# EAGLE design tvc-gamecard-GAL-v2.2smd (EAGLE 8.3.1)
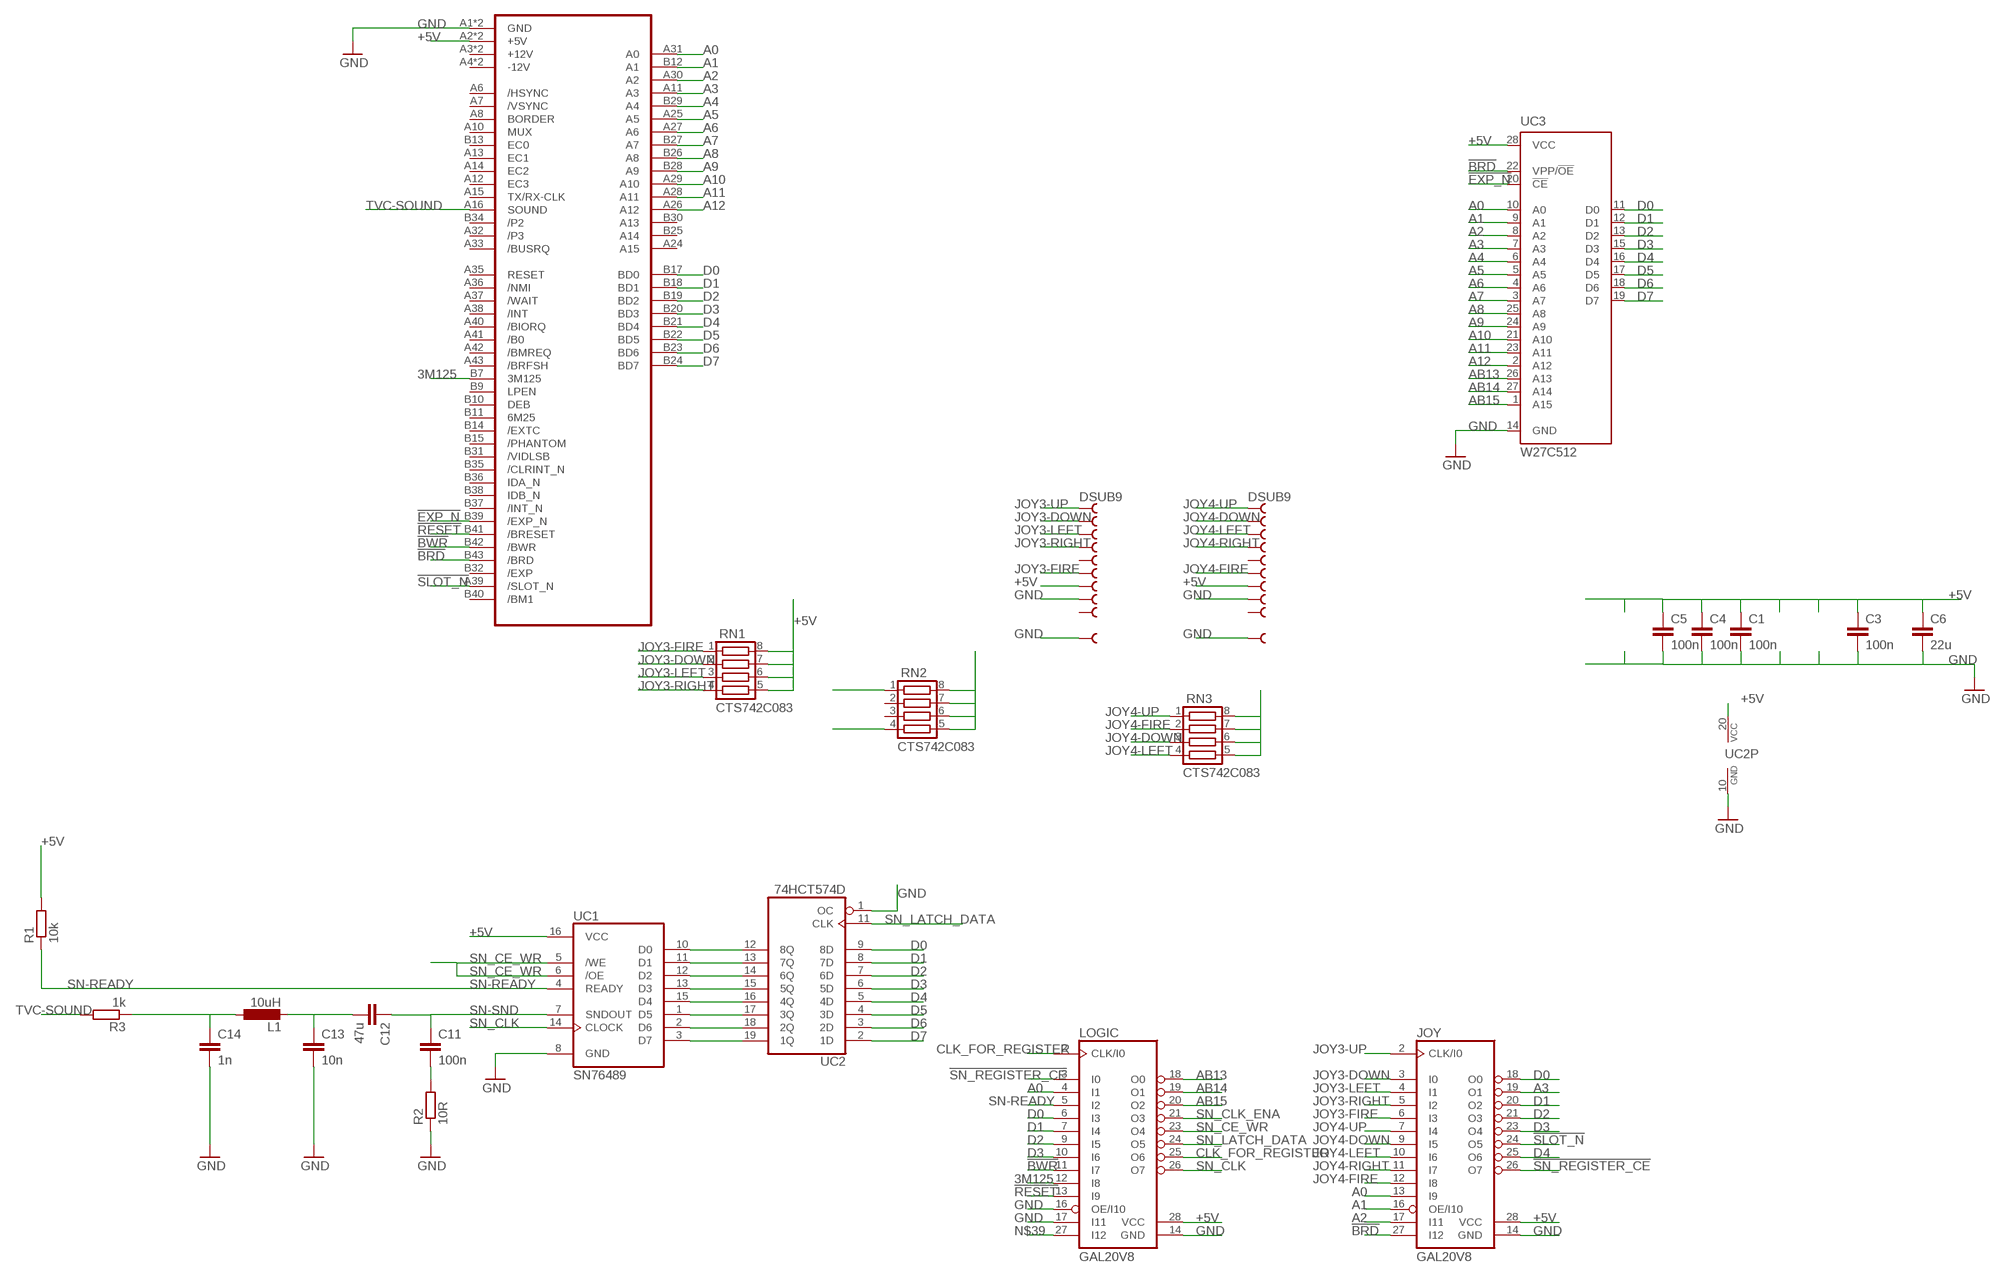
[diagram p0: schematic, sheet 1]

## Parts
C1  100n  C-EUC0805  [C0805]
C3  100n  C-EUC0805  [C0805]
C4  100n  C-EUC0805  [C0805]
C5  100n  C-EUC0805  [C0805]
C6  22u  C-EUC0805  [C0805]
C11  100n  C-EUC0805  [C0805]
C12  47u  C-EUC1206  [C1206]
C13  10n  C-EUC0805  [C0805]
C14  1n  C-EUC0805  [C0805]
CON1  TVC-EXP-HBA-COMMON  [TVC-EXP-EDGE]
JOY  GAL20V8  GAL20V8-PLCC  [PLCC-S28-SOCKET]
JOY3  DSUB9  [H3M09RA]
JOY4  DSUB9  [H3M09RA]
L1  10uH  L-1210  [L1210]
LOGIC  GAL20V8  GAL20V8-PLCC  [PLCC-S28-SOCKET]
R1  10k  R-EU_R0805  [R0805]
R2  10R  R-EU_R0805  [R0805]
R3  1k  R-EU_R0805  [R0805]
RN1  CTS742C083  [CTS742C083]
RN2  CTS742C083  [CTS742C083]
RN3  CTS742C083  [CTS742C083]
UC1  SN76489  [DIL16]
UC2  74HCT574D  [SO20W]
UC3  W27C512  [DIL28-6]

## Nets
3M125: CON1.B7(3M125) LOGIC.12(I8)
!BRD: CON1.B43(/BRD) JOY.27(I12) UC3.22(VPP/!OE)
!BWR: CON1.B42(/BWR) LOGIC.11(I7)
!EXP_N: CON1.B39(/EXP_N) UC3.20(!CE)
!RESET: CON1.B41(/BRESET) LOGIC.13(I9)
!SLOT_N: CON1.A39(/SLOT_N) JOY.24(O5)
!SN_REGISTER_CE: JOY.26(O7) LOGIC.3(I0)
+5V [power]: C1.1 C3.1 C4.1 C5.1 C6.1 CON1.A2(+5V) CON1.B2(+5V) JOY3.7 JOY4.7 JOY.28(VCC) LOGIC.28(VCC) R1.2 RN1.5 RN1.6 RN1.7 RN1.8 RN2.5 RN2.6 RN2.7 RN2.8 RN3.5 RN3.6 RN3.7 RN3.8 UC1.16(VCC) UC2.20(VCC) UC3.28(VCC)
A0: CON1.A31(A0) JOY.13(I9) LOGIC.4(I1) UC3.10(A0)
A1: CON1.B12(A1) JOY.16(OE/I10) UC3.9(A1)
A2: CON1.A30(A2) JOY.17(I11) UC3.8(A2)
A3: CON1.A11(A3) JOY.19(O1) UC3.7(A3)
A4: CON1.B29(A4) UC3.6(A4)
A5: CON1.A25(A5) UC3.5(A5)
A6: CON1.A27(A6) UC3.4(A6)
A7: CON1.B27(A7) UC3.3(A7)
A8: CON1.B26(A8) UC3.25(A8)
A9: CON1.B28(A9) UC3.24(A9)
A10: CON1.A29(A10) UC3.21(A10)
A11: CON1.A28(A11) UC3.23(A11)
A12: CON1.A26(A12) UC3.2(A12)
AB13: LOGIC.18(O0) UC3.26(A13)
AB14: LOGIC.19(O1) UC3.27(A14)
AB15: LOGIC.20(O2) UC3.1(A15)
CLK_FOR_REGISTER: LOGIC.2(CLK/I0) LOGIC.25(O6)
D0: CON1.B17(BD0) JOY.18(O0) LOGIC.6(I3) UC2.9(8D) UC3.11(D0)
D1: CON1.B18(BD1) JOY.20(O2) LOGIC.7(I4) UC2.8(7D) UC3.12(D1)
D2: CON1.B19(BD2) JOY.21(O3) LOGIC.9(I5) UC2.7(6D) UC3.13(D2)
D3: CON1.B20(BD3) JOY.23(O4) LOGIC.10(I6) UC2.6(5D) UC3.15(D3)
D4: CON1.B21(BD4) JOY.25(O6) UC2.5(4D) UC3.16(D4)
D5: CON1.B22(BD5) UC2.4(3D) UC3.17(D5)
D6: CON1.B23(BD6) UC2.3(2D) UC3.18(D6)
D7: CON1.B24(BD7) UC2.2(1D) UC3.19(D7)
GND [power]: C1.2 C3.2 C4.2 C5.2 C6.2 C13.2 C14.2 CON1.A1(GND) CON1.B1(GND) JOY3.8 JOY3.P$1(S) JOY3.P$2(S) JOY4.8 JOY4.P$1(S) JOY4.P$2(S) JOY.14(GND) LOGIC.14(GND) LOGIC.16(OE/I10) LOGIC.17(I11) R2.1 UC1.8(GND) UC2.1(OC) UC2.10(GND) UC3.14(GND)
JOY3-DOWN: JOY3.2 JOY.3(I0) RN1.2
JOY3-FIRE: JOY3.6 JOY.6(I3) RN1.1
JOY3-LEFT: JOY3.3 JOY.4(I1) RN1.3
JOY3-RIGHT: JOY3.4 JOY.5(I2) RN1.4
JOY3-UP: JOY3.1 JOY.2(CLK/I0) RN2.4
JOY4-DOWN: JOY4.2 JOY.9(I5) RN3.3
JOY4-FIRE: JOY4.6 JOY.12(I8) RN3.2
JOY4-LEFT: JOY4.3 JOY.10(I6) RN3.4
JOY4-RIGHT: JOY4.4 JOY.11(I7) RN2.1
JOY4-UP: JOY4.1 JOY.7(I4) RN3.1
N$1: C11.2 R2.2
N$3: C12.2 C13.1 L1.2
N$4: C14.1 L1.1 R3.1
N$6: UC1.10(D0) UC2.12(8Q)
N$7: UC1.11(D1) UC2.13(7Q)
N$8: UC1.12(D2) UC2.14(6Q)
N$9: UC1.13(D3) UC2.15(5Q)
N$10: UC1.15(D4) UC2.16(4Q)
N$11: UC1.1(D5) UC2.17(3Q)
N$12: UC1.2(D6) UC2.18(2Q)
N$13: UC1.3(D7) UC2.19(1Q)
N$39: LOGIC.27(I12)
SN-READY: LOGIC.5(I2) R1.1 UC1.4(READY)
SN-SND: C11.1 C12.1 UC1.7(SNDOUT)
SN_CE_WR: LOGIC.23(O4) UC1.5(/WE) UC1.6(/OE)
SN_CLK: LOGIC.26(O7) UC1.14(CLOCK)
SN_CLK_ENA: LOGIC.21(O3)
SN_LATCH_DATA: LOGIC.24(O5) UC2.11(CLK)
TVC-SOUND: CON1.A16(SOUND) R3.2
Unconnected: CON1.A3(+12V) CON1.A4(-12V) CON1.A6(/HSYNC) CON1.A7(/VSYNC) CON1.A8(BORDER) CON1.A10(MUX) CON1.A12(EC3) CON1.A13(EC1) CON1.A14(EC2) CON1.A15(TX/RX-CLK) CON1.A24(A15) CON1.A32(/P3) CON1.A33(/BUSRQ) CON1.A35(RESET) CON1.A36(/NMI) CON1.A37(/WAIT) CON1.A38(/INT) CON1.A40(/BIORQ) CON1.A41(/B0) CON1.A42(/BMREQ) CON1.A43(/BRFSH) CON1.B3(+12V) CON1.B4(-12V) CON1.B9(LPEN) CON1.B10(DEB) CON1.B11(6M25) CON1.B13(EC0) CON1.B14(/EXTC) CON1.B15(/PHANTOM) CON1.B25(A14) CON1.B30(A13) CON1.B31(/VIDLSB) CON1.B32(/EXP) CON1.B34(/P2) CON1.B35(/CLRINT_N) CON1.B36(IDA_N) CON1.B37(/INT_N) CON1.B38(IDB_N) CON1.B40(/BM1) JOY3.5 JOY3.9 JOY4.5 JOY4.9 RN2.2 RN2.3

## Library data of the parts
C1 C3-C6 C11-C14 = rcl:C-EU: CAPACITOR, European symbol
CON1 = tvc-exp:TVC-EXP-HBA-COMMON: Videoton TV-Computer expansion port edge connector, common pins for 32k, 64k and 64k+
JOY LOGIC = Lattice:GAL20V8-PLCC
JOY3 JOY4 = dsub90:DSUB9
L1 = SMD-L:L-1210
R1-R3 = rcl:R-EU_: RESISTOR, European symbol
RN1-RN3 = resistor-net:CTS742C083: Chip Resistor Array 4 Single Resistor Source: http://www.ctscorp.com/components/Datasheets/CTSChipArrayDs.pdf; OC_FARNELL: unknown; OC_NEWARK: unknown
UC1 = sn76489:SN76489
UC2 = 74xx-eu:74*574: 8-bit D type FLIP FLOP bus driver
UC3 = Winbond:W27C512

## Net classes
1 power: width 0.508 mm, clearance 0.254 mm

## Board
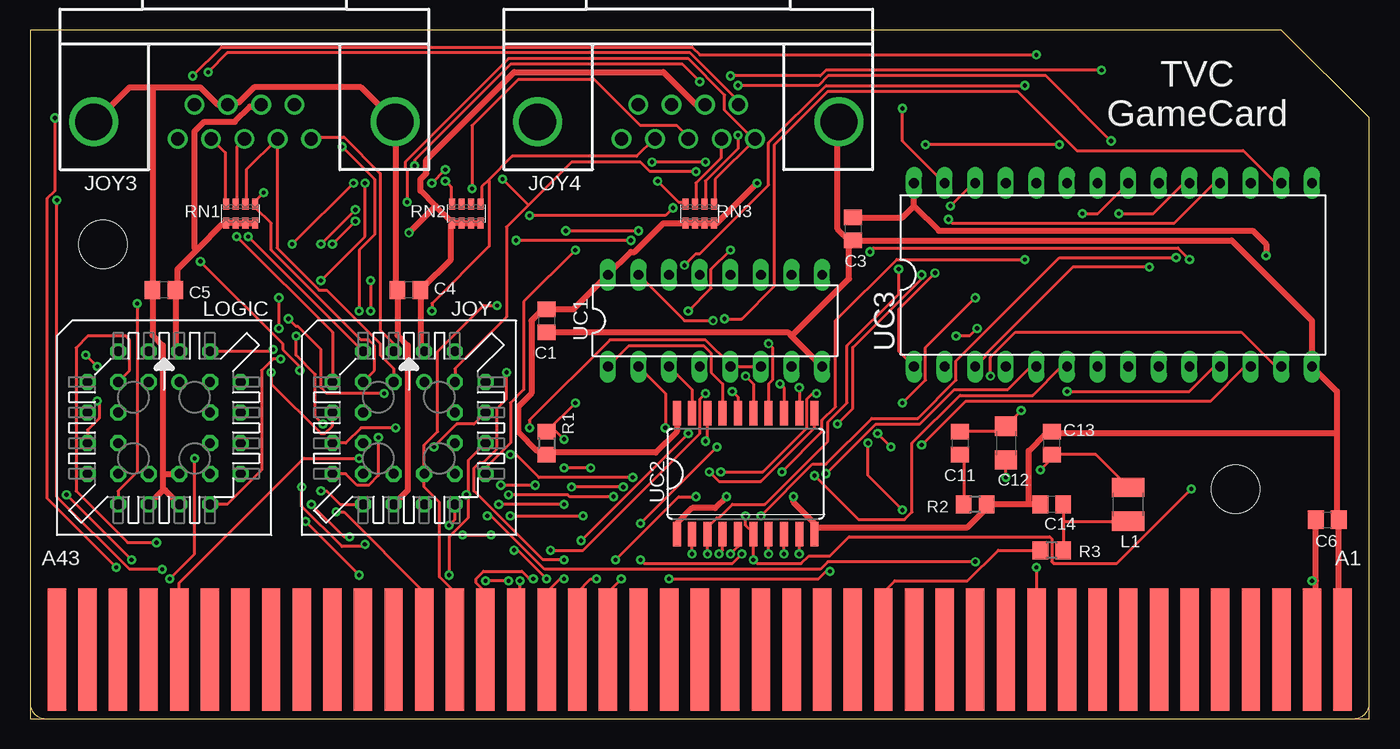
[diagram p1: board, top side]
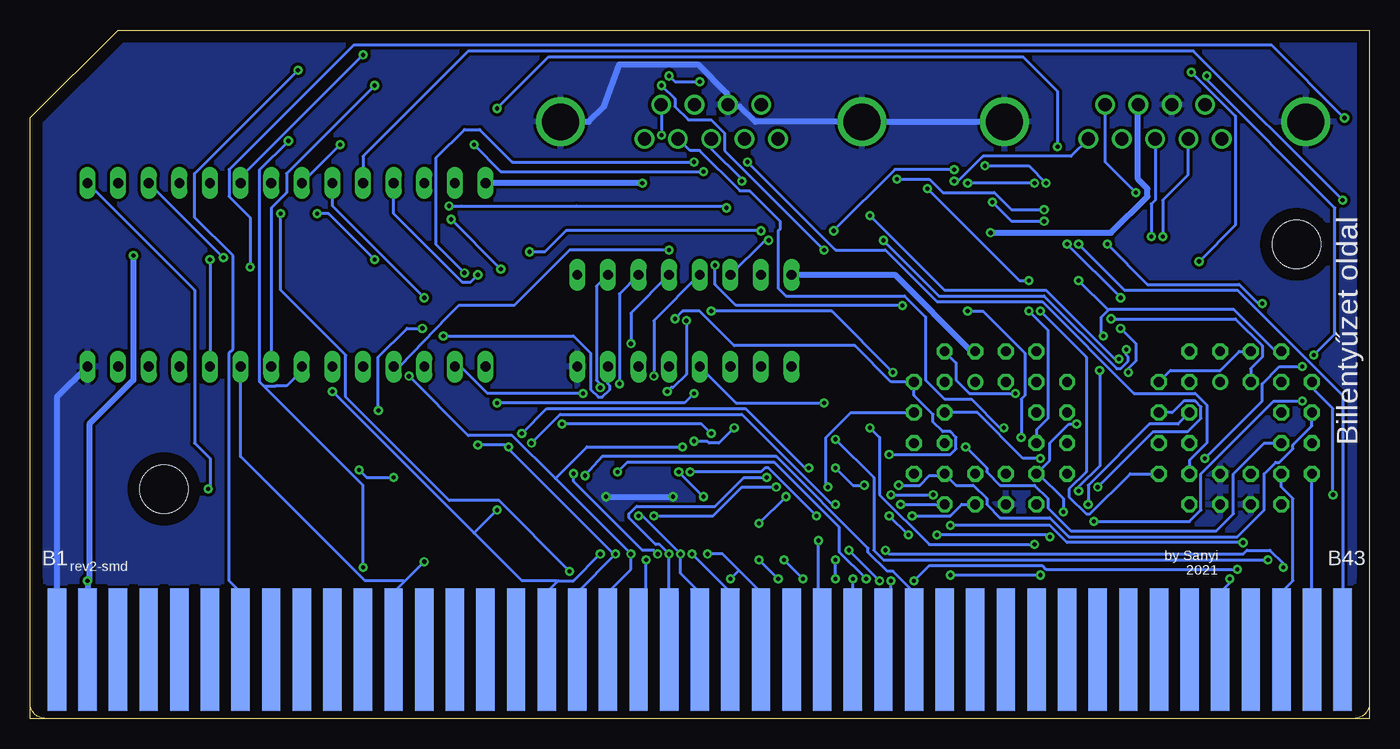
[diagram p2: board, bottom side, seen from below]

Size 111.12 x 57.14 mm. Coordinates in mm from the lower left corner, seen from the top.
Outline: 0,0 111.11,0 111.11,49.86 103.83,57.14 0,57.14 0,0
Copper layers (1*16): Top 0.035mm / dielectric 1.5mm / Bottom 0.035mm
Design rules "default *": minimum track width 10mil, minimum drill 0.35mm, track to track 6mil, track to pad 6mil, pad to pad 6mil, via to via 6mil, smd to smd 6mil, copper to edge 40mil, drill to drill 6mil, minimum pad ring 10mil, minimum via ring 8mil, stop-mask expansion 4mil, vias tented up to drill 15mil, thermal gap 10mil
Holes 4 mm at 6.03,39.37 100.01,19.05

### Footprints (pad centres in the part's own frame; a part is rotated, then mirrored left to right if it is on the bottom)
C0805 = smd 1.3 x 1.5: 1 -0.95,0; 2 0.95,0
C1206 = smd 1.6 x 1.8: 1 -1.4,0; 2 1.4,0
TVC-EXP-EDGE = smd 1.524 x 10.16: A1 53.34,-5.715; A2 50.8,-5.715; A3 48.26,-5.715; A4 45.72,-5.715; A5 43.18,-5.715; A6 40.64,-5.715; A7 38.1,-5.715; A8 35.56,-5.715; A9 33.02,-5.715; A10 30.48,-5.715; A11 27.94,-5.715; A12 25.4,-5.715; A13 22.86,-5.715; A14 20.32,-5.715; A15 17.78,-5.715; A16 15.24,-5.715; A17 12.7,-5.715; A18 10.16,-5.715; A19 7.62,-5.715; A20 5.08,-5.715; A21 2.54,-5.715; A22 0,-5.715; A23 -2.54,-5.715; A24 -5.08,-5.715; A25 -7.62,-5.715; A26 -10.16,-5.715; A27 -12.7,-5.715; A28 -15.24,-5.715; A29 -17.78,-5.715; A30 -20.32,-5.715; A31 -22.86,-5.715; A32 -25.4,-5.715; A33 -27.94,-5.715; A34 -30.48,-5.715; A35 -33.02,-5.715; A36 -35.56,-5.715; A37 -38.1,-5.715; A38 -40.64,-5.715; A39 -43.18,-5.715; A40 -45.72,-5.715; A41 -48.26,-5.715; A42 -50.8,-5.715; A43 -53.34,-5.715 | smd 1.524 x 10.16 bottom: B1 53.34,-5.715; B2 50.8,-5.715; B3 48.26,-5.715; B4 45.72,-5.715; B5 43.18,-5.715; B6 40.64,-5.715; B7 38.1,-5.715; B8 35.56,-5.715; B9 33.02,-5.715; B10 30.48,-5.715; B11 27.94,-5.715; B12 25.4,-5.715; B13 22.86,-5.715; B14 20.32,-5.715; B15 17.78,-5.715; B16 15.24,-5.715; B17 12.7,-5.715; B18 10.16,-5.715; B19 7.62,-5.715; B20 5.08,-5.715; B21 2.54,-5.715; B22 0,-5.715; B23 -2.54,-5.715; B24 -5.08,-5.715; B25 -7.62,-5.715; B26 -10.16,-5.715; B27 -12.7,-5.715; B28 -15.24,-5.715; B29 -17.78,-5.715; B30 -20.32,-5.715; B31 -22.86,-5.715; B32 -25.4,-5.715; B33 -27.94,-5.715; B34 -30.48,-5.715; B35 -33.02,-5.715; B36 -35.56,-5.715; B37 -38.1,-5.715; B38 -40.64,-5.715; B39 -43.18,-5.715; B40 -45.72,-5.715; B41 -48.26,-5.715; B42 -50.8,-5.715; B43 -53.34,-5.715
PLCC-S28-SOCKET = drill 0.813: 1 1.27,3.81 | drill 0.813 octagon: 2 -1.27,6.35; 3 -1.27,3.81; 4 -3.81,6.35; 5 -6.35,3.81; 6 -3.81,3.81; 7 -6.35,1.27; 8 -3.81,1.27; 9 -6.35,-1.27; 10 -3.81,-1.27; 11 -6.35,-3.81; 12 -3.81,-6.35; 13 -3.81,-3.81; 14 -1.27,-6.35; 15 -1.27,-3.81; 16 1.27,-6.35; 17 1.27,-3.81; 18 3.81,-6.35; 19 6.35,-3.81; 20 3.81,-3.81; 21 6.35,-1.27; 22 3.81,-1.27; 23 6.35,1.27; 24 3.81,1.27; 25 6.35,3.81; 26 3.81,6.35; 27 3.81,3.81; 28 1.27,6.35
H3M09RA = drill 1.092: 1 -5.537,1.422; 2 -2.769,1.422; 3 0,1.422; 4 2.769,1.422; 5 5.537,1.422; 6 -4.153,-1.422; 7 -1.384,-1.422; 8 1.384,-1.422; 9 4.153,-1.422 | drill 3.048 pad 4.064: P$1 -12.497,0; P$2 12.497,0
L1210 = smd 1.6 x 2.7: 1 -1.4,0; 2 1.4,0
R0805 = smd 1.3 x 1.5: 1 -0.95,0; 2 0.95,0
CTS742C083 = smd 0.5 x 0.9: 1 -1.2,-0.8; 2 -0.4,-0.8; 3 0.4,-0.8; 4 1.2,-0.8; 5 1.2,0.8; 6 0.4,0.8; 7 -0.4,0.8; 8 -1.2,0.8
DIL16 = drill 0.813 long: 1 -8.89,-3.81; 2 -6.35,-3.81; 3 -3.81,-3.81; 4 -1.27,-3.81; 5 1.27,-3.81; 6 3.81,-3.81; 7 6.35,-3.81; 8 8.89,-3.81; 9 8.89,3.81; 10 6.35,3.81; 11 3.81,3.81; 12 1.27,3.81; 13 -1.27,3.81; 14 -3.81,3.81; 15 -6.35,3.81; 16 -8.89,3.81
SO20W = smd 0.66 x 2.032: 1 -5.715,-5.029; 2 -4.445,-5.029; 3 -3.175,-5.029; 4 -1.905,-5.029; 5 -0.635,-5.029; 6 0.635,-5.029; 7 1.905,-5.029; 8 3.175,-5.029; 9 4.445,-5.029; 10 5.715,-5.029; 11 5.715,5.029; 12 4.445,5.029; 13 3.175,5.029; 14 1.905,5.029; 15 0.635,5.029; 16 -0.635,5.029; 17 -1.905,5.029; 18 -3.175,5.029; 19 -4.445,5.029; 20 -5.715,5.029
DIL28-6 = drill 0.813 long: 1 -16.51,-7.62; 2 -13.97,-7.62; 3 -11.43,-7.62; 4 -8.89,-7.62; 5 -6.35,-7.62; 6 -3.81,-7.62; 7 -1.27,-7.62; 8 1.27,-7.62; 9 3.81,-7.62; 10 6.35,-7.62; 11 8.89,-7.62; 12 11.43,-7.62; 13 13.97,-7.62; 14 16.51,-7.62; 15 16.51,7.62; 16 13.97,7.62; 17 11.43,7.62; 18 8.89,7.62; 19 6.35,7.62; 20 3.81,7.62; 21 1.27,7.62; 22 -1.27,7.62; 23 -3.81,7.62; 24 -6.35,7.62; 25 -8.89,7.62; 26 -11.43,7.62; 27 -13.97,7.62; 28 -16.51,7.62

### Placement (x,y rotation side)
C1  42.86,33.02 270 top
C3  68.26,40.64 270 top
C4  31.43,35.56 180 top
C5  11.11,35.56 180 top
C6  107.63,16.51 0 top
C11  77.15,22.86 270 top
C12  80.96,22.86 270 top
C13  84.77,22.86 90 top
C14  84.77,17.78 180 top
CON1  55.56,11.43 0 top
JOY  31.43,24.13 0 top
JOY3  17.78,49.53 180 top
JOY4  54.61,49.53 180 top
L1  91.12,17.78 90 top
LOGIC  11.11,24.13 0 top
R1  42.86,22.86 270 top
R2  78.42,17.78 180 top
R3  84.77,13.97 180 top
RN1  17.46,41.91 180 top
RN2  36.2,41.91 180 top
RN3  55.56,41.91 180 top
UC1  56.83,33.02 0 top
UC2  59.37,20.32 0 top
UC3  89.85,36.83 0 top

### Tracks (layer width: path | path; a pad name or v marks a point on that pad's centre or on a via)
3M125  (via drill 0.35)
  Top 0.254: LOGIC.12 7.3,18.89 8.89,20.48 v8.89,34.45 | v26.83,44.45 v21.75,39.37 | v31.91,45.88 31.91,46.35 39.85,54.29 54.13,54.29 v55.56,52.86 | v58.1,53.34 65.56,53.34 66.04,53.82 v88.9,53.82
  Bottom 0.254: v8.89,34.45 9.21,34.45 10.8,36.04 18.42,36.04 v21.75,39.37 | v26.83,44.45 28.26,45.88 v31.91,45.88 | v55.56,52.86 57.63,52.86 v58.1,53.34 | v88.9,53.82 97.47,45.24 97.47,41.59 94.3,38.42 94.3,30.64 94.62,30.32 94.62,11.43 93.66,10.48 CON1.B7
!BRD  (via drill 0.35)
  Top 0.254: JOY.27 35.24,29.05 39.53,33.34 39.53,40.8 41.35,42.62 | 41.35,42.62 44.93,46.2 50.64,46.2 51.43,45.4 v55.24,45.4 | v85.41,47.62 v74.29,47.62 | v26.99,42.23 v24.13,39.37 | 41.35,42.62 v39.21,44.77
  Bottom 0.254: v55.24,45.4 72.07,45.4 v74.29,47.62 | UC3.22 v85.41,47.62 | CON1.B43 2.22,26.83 10.95,35.56 20.32,35.56 v24.13,39.37 | v26.99,42.23 29.69,42.23 31.12,43.66 35.4,43.66 36.51,44.77 v39.21,44.77
!BWR
  Bottom 0.254: CON1.B42 LOGIC.11
!EXP_N  (via drill 0.35)
  Top 0.254: v83.5,55.09 55.56,55.09 54.93,55.72 15.87,55.72 v13.49,53.34 | v5.56,29.21 v4.6,30.16 | v13.65,21.59 13.65,13.65 v11.59,11.59
  Bottom 0.254: UC3.20 93.66,44.93 v83.5,55.09 | v13.49,53.34 13.49,53.02 2.86,42.39 2.86,31.91 v4.6,30.16 | v5.56,29.21 7.46,29.21 8.89,27.78 8.89,26.35 v13.65,21.59 | v11.59,11.59 11.59,11.27 12.38,10.48 CON1.B39
!RESET
  Bottom 0.254: LOGIC.13 7.3,19.21 6.35,18.26 6.35,11.43 7.3,10.48 CON1.B41
!SLOT_N  (via drill 0.35)
  Top 0.254: v27.3,21.59 22.7,21.59 12.38,11.27 CON1.A39
  Bottom 0.254: JOY.24 32.54,25.4 28.73,21.59 v27.3,21.59
!SN_REGISTER_CE  (via drill 0.35)
  Top 0.254: v29.37,26.99 24.61,26.99 24.13,27.46 24.13,30.64 22.23,32.54 22.07,32.54 v21.43,33.18
  Bottom 0.254: LOGIC.3 9.84,29.05 8.89,30 8.89,30.96 11.11,33.18 v21.43,33.18 | v29.37,26.99 33.18,26.99 34.29,28.1 34.29,29.53 JOY.26
+5V  (via drill 0.35)
  Top 0.508: LOGIC.28 12.06,30.8 C5.1 12.22,35.72 12.22,37.31 13.81,38.89 | JOY.28 32.38,30.8 C4.1 32.54,35.72 34.92,38.1 34.92,40.96 RN2.5 | C3.1 72.39,41.59 73.34,42.55 | 73.34,42.55 UC3.28 | RN1.8 18.57,41.12 18.1,41.12 RN1.7 17.78,41.12 17.3,41.12 RN1.6 16.99,41.12 16.35,41.12 RN1.5 16.03,41.12 13.81,38.89 | JOY3.7 19.05,50.8 18.26,50.8 16.99,49.53 14.45,49.53 13.65,48.74 13.65,39.05 13.81,38.89 | RN2.5 35.08,41.12 35.72,41.12 RN2.6 36.04,41.12 36.51,41.12 RN2.7 36.83,41.12 37.31,41.12 RN2.8 | 33.65,42.55 34.92,41.27 RN2.5 | 33.65,42.55 32.39,43.81 32.39,44.77 32.86,45.24 32.86,46.35 40.16,53.66 52.55,53.66 55.24,50.96 55.88,50.96 JOY4.7 | 33.65,42.55 v31.43,40.32 | 106.68,11.43 106.68,6.03 CON1.B2 | 106.68,11.43 C6.1 | v106.36,11.43 106.68,11.43 | UC2.20 53.66,23.81 51.91,22.07 42.86,22.07 R1.2 42.7,22.23 42.07,22.23 40.48,23.81 40.48,25.88 41.59,26.99 41.59,33.02 42.7,34.13 C1.1 45.08,33.97 UC1.16 49.85,38.73 50.17,38.73 52.55,41.12 54.13,41.12 RN3.5 54.45,41.12 55.09,41.12 RN3.6 55.4,41.12 55.88,41.12 RN3.7 56.2,41.12 56.67,41.12 RN3.8 56.99,41.12 v60.32,44.45 | v102.55,38.42 102.55,39.37 101.44,40.48 75.41,40.48 73.34,42.55
  Bottom 0.508: v31.43,40.32 21.43,40.32 18.42,43.34 18.42,43.97 19.21,44.77 19.21,50.8 JOY3.7 | CON1.B2 v106.36,11.43 106.2,11.59 106.2,24.45 102.55,28.1 v102.55,38.42 | v60.32,44.45 UC3.28 | JOY.28 33.02,30.48 39.37,36.83 UC1.16
A0  (via drill 0.35)
  Top 0.254: v22.07,31.75 22.07,30.16 23.65,28.57 23.65,25.08 v24.29,24.45 | v96.2,38.1 95.25,39.05 70.01,39.05 v69.69,38.73 | v44.45,40.48 v50.48,40.48 | v33.34,44.45 v34.45,45.56 | v27.78,44.45 27.78,40.01 v24.13,36.35 | CON1.A31 32.7,10.48 26.03,17.14 v25.4,17.14
  Bottom 0.254: LOGIC.4 7.78,30.48 11.27,33.97 21.59,33.97 21.67,33.89 | 21.67,33.89 22.23,33.34 22.23,31.91 v22.07,31.75 | v24.29,24.45 24.92,24.45 26.51,22.86 26.51,21.43 JOY.13 27.46,20.32 25.4,18.26 v25.4,17.14 | v96.2,38.1 UC3.10 | v69.69,38.73 68.42,38.73 66.68,40.48 v50.48,40.48 | v44.45,40.48 39.37,45.56 v34.45,45.56 | v27.78,44.45 v33.34,44.45 | 21.67,33.89 v24.13,36.35
A1  (via drill 0.35)
  Top 0.254: v37.94,16.83 38.26,16.83 42.7,12.38 65.56,12.38 66.2,13.02 v78.42,13.02
  Bottom 0.254: JOY.16 33.81,17.78 34.77,16.83 v37.94,16.83 | 80.09,11.35 80.96,10.48 CON1.B12 | 80.09,11.35 v78.42,13.02 | UC3.9 93.66,21.75 83.34,11.43 80.17,11.43 80.09,11.35
A2  (via drill 0.35)
  Top 0.254: CON1.A30 35.24,10.48 33.97,11.75 33.97,17.94 32.7,19.21 JOY.17 32.7,22.7 33.81,23.81 33.81,30.48 37.62,34.29 v38.74,34.29 | v82.55,52.55 66.04,52.55 61.28,47.78 61.28,44.29 55.56,38.58 55.24,38.58 v54.29,37.62
  Bottom 0.254: UC3.8 91.12,42.39 89.85,43.66 89.85,45.24 v82.55,52.55 | v54.29,37.62 54.29,36.04 52.55,34.29 v38.74,34.29
A3  (via drill 0.35)
  Top 0.254: JOY.19 37.78,20.8 39.85,22.86 39.85,26.19 40.96,27.3 40.96,34.61 v45.24,38.89 | v58.74,52.55 65.4,52.55 66.2,53.34 84.3,53.34 v89.69,47.94 | v83.5,12.54 CON1.A11
  Bottom 0.254: v45.24,38.89 53.5,47.15 53.5,48.58 54.61,49.69 56.52,49.69 57.63,50.8 57.63,51.44 v58.74,52.55 | v89.69,47.94 92.07,45.56 92.07,27.94 91.74,27.61 | v83.5,12.54 83.5,19.37 91.74,27.61 | UC3.7 88.58,28.89 89.85,27.62 90.72,27.62 90.73,27.61 91.74,27.61
A4  (via drill 0.35)
  Top 0.254: UC3.6 85.57,29.21 83.18,26.83 77.15,26.83 73.18,22.86 73.18,17.14 72.55,16.51 68.74,16.51 v65.09,20.16
  Bottom 0.254: v65.09,20.16 63.66,21.75 49.21,21.75 41.59,14.13 41.59,13.81 40,12.22 39.53,12.22 37.78,10.48 CON1.B29
A5  (via drill 0.35)
  Top 0.254: UC3.5 83.03,29.21 81.12,27.3 76.68,27.3 73.82,24.45 70.17,24.45 v66.04,20.32 | v59.06,13.65 58.26,12.86 50.96,12.86 v50.64,13.18 | v49.05,11.59 47.94,10.48 CON1.A25
  Bottom 0.254: v66.04,20.32 66.04,19.68 60.32,13.97 59.37,13.97 v59.06,13.65 | v49.05,11.59 v50.64,13.18
A6  (via drill 0.35)
  Top 0.254: v58.1,38.89 56.52,37.31 56.52,35.72 v54.61,33.81 | v39.53,28.73 39.53,26.51 38.74,25.72 38.74,22.38 37.62,21.27 37.31,21.27 36.83,20.8 36.83,18.89 42.54,13.18 v44.29,13.18 | v44.29,11.59 43.97,11.59 42.86,10.48 CON1.A27
  Bottom 0.254: UC3.4 80.49,29.21 76.52,33.34 75.56,34.29 70.96,34.29 66.36,38.89 v58.1,38.89 | v54.61,33.81 44.61,33.81 v39.53,28.73 | v44.29,11.59 v44.29,13.18
A7  (via drill 0.35)
  Top 0.254: UC3.3 79.22,30 79.22,30.16 86.52,37.47 v92.87,37.47 | v2.06,49.85 2.06,43.81 1.43,43.18 1.43,18.26 v7.14,12.54 | v40.16,13.97 40.48,13.97 v42.86,11.59
  Bottom 0.254: v92.87,37.47 92.87,41.59 94.62,43.34 94.62,45.56 84.3,55.88 8.1,55.88 v2.06,49.85 | v7.14,12.54 7.14,12.86 8.25,13.97 10.16,13.97 10.48,13.65 39.85,13.65 v40.16,13.97 | CON1.B27 v42.86,11.59
A8  (via drill 0.35)
  Top 0.254: v73.98,36.83 73.98,36.51 68.26,30.8 68.26,25.72 v66.99,24.45 | v45.72,14.76 v54.61,23.65
  Bottom 0.254: UC3.25 80.96,41.91 75.25,36.2 74.61,36.2 v73.98,36.83 | v66.99,24.45 55.4,24.45 v54.61,23.65 | v45.72,14.76 45.72,6.03 CON1.B26
A9  (via drill 0.35)
  Top 0.254: v2.22,43.02 2.22,18.41 8.25,12.38 v10.95,12.38 | v39.69,11.43 v37.78,11.43
  Bottom 0.254: v2.22,43.02 14.6,55.4 74.77,55.4 83.5,46.67 UC3.24 | v10.95,12.38 26.83,12.38 27.15,12.7 36.51,12.7 v37.78,11.43 | v39.69,11.43 39.69,6.35 CON1.B28
A10  (via drill 0.35)
  Top 0.254: v87.31,41.91 88.58,41.91 UC3.21 | v82.55,38.1 71.91,38.1 66.83,33.02 66.83,25.88 65.72,24.77 65.72,23.81 v62.39,20.48 | v41.75,11.59 41.43,11.59 40.8,12.22 37.62,12.22 36.99,11.59 36.99,11.27 37.78,10.48 CON1.A29
  Bottom 0.254: v87.31,41.91 86.36,41.91 v82.55,38.1 | v41.75,11.59 43.97,13.81 43.97,15.88 49.37,21.27 61.6,21.27 v62.39,20.48
A11  (via drill 0.35)
  Top 0.254: v78.42,34.92 74.29,30.8 74.29,28.1 v72.39,26.19 | v56.04,26.99 55.56,26.51 55.56,23.65 45.88,13.97 v43.18,13.97 | v40.64,11.43 40.64,6.03 CON1.A28
  Bottom 0.254: UC3.23 86.04,42.55 v78.42,34.92 | v72.39,26.19 56.83,26.19 v56.04,26.99 | v40.64,11.43 v43.18,13.97
A12  (via drill 0.35)
  Top 0.254: v65.25,26.99 64.93,26.99 64.45,26.51 64.45,24.13 60.8,20.48 v57.31,20.48 | v55.24,18.41 53.82,18.41 v48.58,13.18 | v46.99,11.59 46.51,11.59 45.4,10.48 CON1.A26
  Bottom 0.254: UC3.2 75.41,29.21 73.18,26.99 v65.25,26.99 | v55.24,18.41 v57.31,20.48 | v46.99,11.59 v48.58,13.18
AB13  (via drill 0.35)
  Top 0.254: LOGIC.18 16.35,17.78 19.21,20.64 19.21,28.89 20.16,29.84 v20.8,29.84 | v41.43,41.75 52.71,41.75 v53.34,42.39 | v76.36,42.55 78.26,44.45 UC3.26
  Bottom 0.254: v20.8,29.84 21.11,29.84 26.83,35.56 35.24,35.56 v41.43,41.75 | v76.36,42.55 75.33,42.55 65.79,42.53 53.49,42.53 v53.34,42.39
AB14  (via drill 0.35)
  Top 0.254: v27.3,33.81 27.3,38.89 28.57,40.16 28.57,44.77 v25.88,47.47 | UC3.27 72.39,47.94 v72.39,50.64
  Bottom 0.254: LOGIC.19 19.84,20.32 23.18,16.99 23.49,16.99 24.92,18.41 24.92,19.05 23.49,20.48 23.49,30 v27.3,33.81 | v25.88,47.47 25.88,52.07 28.73,54.93 68.1,54.93 v72.39,50.64
AB15  (via drill 0.35)
  Top 0.254: v56.04,46.2 v51.59,46.2 | v75.09,36.99 72.07,33.97 72.07,30.48 UC3.1
  Bottom 0.254: LOGIC.20 14.92,21.43 13.49,22.86 13.49,26.04 14.45,26.99 19.53,26.99 27.15,34.61 35.88,34.61 40.16,38.89 44.29,38.89 v51.59,46.2 | v56.04,46.2 71.12,46.2 73.82,48.9 75.09,48.9 77.47,46.51 77.47,39.37 v75.09,36.99
CLK_FOR_REGISTER
  Bottom 0.254: LOGIC.2 10.8,30.48 12.38,28.89 16.51,28.89 LOGIC.25
D0  (via drill 0.35)
  Top 0.254: JOY.18 35.24,16.51 v34.77,16.03 | v10.48,14.61 8.1,14.61 3.81,18.89 3.81,30.76 4.8,31.75 7.94,31.75 8.25,31.43 8.25,28.89 LOGIC.6 | v63.82,13.65 UC2.9 | UC3.11 98.27,29.21 96.2,27.15 v86.04,27.15 | v44.29,17.78 v38.89,17.78 | v69.53,22.86 69.53,20.16 v72.39,17.3
  Bottom 0.254: v34.77,16.03 26.51,16.03 25.08,14.61 v10.48,14.61 | v63.82,13.65 66.04,11.43 67.31,11.43 67.39,11.35 | 67.39,11.35 68.26,10.48 CON1.B17 | 74.29,15.4 70.33,11.43 67.47,11.43 67.39,11.35 | 74.29,15.4 v86.04,27.15 | v38.89,17.78 JOY.18 | v44.29,17.78 44.61,17.78 52.07,25.24 67.15,25.24 v69.53,22.86 | 74.29,15.4 v72.39,17.3
D1  (via drill 0.35)
  Top 0.254: v62.55,13.65 UC2.8 | UC3.12 100.81,29.21 97.95,26.35 77.63,26.35 v73.98,22.7 | v41.91,19.37 v39.05,19.37 | v46.51,20.8 v44.29,20.8 | v71.44,22.54 v70.33,23.65
  Bottom 0.254: LOGIC.7 4.76,24.29 6.35,22.7 6.35,22.38 7.46,21.27 7.78,21.27 8.73,20.32 8.73,17.3 10.95,15.08 24.92,15.08 26.51,16.67 30.64,16.67 31.75,17.78 31.75,18.26 32.86,19.37 34.29,19.37 JOY.20 35.24,20.16 36.51,20.16 37.31,19.37 v39.05,19.37 | CON1.B18 65.72,10.48 v62.55,13.65 62.71,13.65 71.52,22.46 | v73.98,22.7 71.76,22.7 71.52,22.46 | v41.91,19.37 42.86,19.37 v44.29,20.8 | v46.51,20.8 46.83,20.8 51.75,25.72 68.26,25.72 v70.33,23.65 | v71.44,22.54 71.52,22.46
D2  (via drill 0.35)
  Top 0.254: LOGIC.9 4.76,23.97 5.71,24.92 5.71,26.19 v5.56,26.35 | v27.3,11.91 v22.86,16.35 | v34.77,11.91 34.77,15.08 36.35,16.67 36.35,18.57 | 36.35,18.57 36.35,21.43 JOY.21 | v61.28,13.65 UC2.7 | UC3.13 103.35,29.21 100.49,32.07 81.76,32.07 79.69,30 v79.69,28.42 | v36.2,18.57 36.35,18.57 | v39.69,18.57 44.61,18.57 44.77,18.41 v48.42,18.41 | v56.99,22.54 v50.64,16.19
  Bottom 0.254: v5.56,26.35 7.94,26.35 13.97,20.32 13.97,17.3 14.92,16.35 v22.86,16.35 | v34.77,11.91 v27.3,11.91 | CON1.B19 63.18,10.48 61.28,12.38 v61.28,13.65 67.55,19.92 | v79.69,28.42 74.77,23.5 71.12,23.5 67.55,19.92 | v39.69,18.57 v36.2,18.57 | v50.64,16.19 v48.42,18.41 | v56.99,22.54 64.93,22.54 67.55,19.92
D3  (via drill 0.35)
  Top 0.254: v33.5,22.54 35.4,24.45 36.83,24.45 JOY.23 | v96.36,19.05 90.17,12.86 84.93,12.86 84.77,13.02 84.77,14.92 84.61,15.08 67.95,15.08 66.36,13.49 64.61,13.49 63.98,12.86 60.32,12.86 v60.01,13.18 UC2.6 60.01,15.4 59.37,16.03 v59.37,16.83 | v49.21,19.21 v44.93,19.21
  Bottom 0.254: LOGIC.10 8.73,22.86 11.27,20.32 11.27,16.99 12.7,15.56 24.76,15.56 26.67,17.46 26.67,18.26 27.78,19.37 30.64,19.37 31.75,20.48 31.75,20.8 v33.5,22.54 | v60.01,13.18 60.01,6.35 CON1.B20 | UC3.15 97.47,35.56 97.47,22.86 96.2,21.59 96.2,19.21 v96.36,19.05 | JOY.23 43.02,25.4 45.09,23.34 45.09,19.37 v44.93,19.21 | v49.21,19.21 52.07,19.21 54.45,16.83 v59.37,16.83
D4  (via drill 0.35)
  Top 0.254: UC2.5 58.74,14.29 v58.1,13.65 | v39.85,21.91 40.32,21.91 42.23,20 v50.01,20 | UC3.16 103.35,44.45 100.65,47.15 86.84,47.15 81.92,52.07 66.2,52.07 61.75,47.62 61.75,35.88 59.06,33.18 v57.63,33.18
  Bottom 0.254: CON1.B21 v58.1,13.65 58.9,14.45 59.21,14.45 61.44,16.67 61.44,16.99 60.8,17.62 54.29,17.62 51.91,20 v50.01,20 | v39.85,21.91 34.77,21.91 34.29,22.38 34.29,23.34 34.77,23.81 35.4,23.81 36.2,24.61 36.2,25.24 37.78,26.83 JOY.25 39.69,27.94 42.7,30.96 52.71,30.96 55.56,33.81 56.99,33.81 v57.63,33.18
D5  (via drill 0.35)
  Top 0.254: UC2.4 57.47,13.97 v57.15,13.65 | v95.09,38.26 85.41,38.26 76.84,29.69 76.84,28.1 73.66,24.92 69.85,24.92 66.04,21.11 64.93,21.11 v60.64,16.83
  Bottom 0.254: CON1.B22 55.56,10.48 57.15,12.06 v57.15,13.65 60.32,16.83 v60.64,16.83 | v95.09,38.26 UC3.17
D6  (via drill 0.35)
  Top 0.254: v56.2,13.65 UC2.3 56.2,15.88 56.99,16.67 57.15,16.67 58.26,17.78 60.96,17.78 66.2,23.02 66.2,24.61 67.79,26.19 67.79,30.96 72.07,35.24 v72.07,37.31 | UC3.18 98.27,44.45 94.93,41.12 76.52,41.12 v76.2,41.43
  Bottom 0.254: v56.2,13.65 53.02,10.48 CON1.B23 | v72.07,37.31 v76.2,41.43
D7  (via drill 0.35)
  Top 0.254: v54.93,13.65 UC2.2 | UC3.19 95.73,44.45 93.19,41.91 v90.33,41.91 | v66.36,12.22 66.04,12.22 65.4,11.59 v53.02,11.59
  Bottom 0.254: v54.93,13.65 53.66,13.65 52.31,12.3 | 52.31,12.3 50.48,10.48 CON1.B24 | v90.33,41.91 90.33,35.56 84.93,30.16 84.93,26.67 76.36,18.1 72.23,18.1 v66.36,12.22 | 52.31,12.3 v53.02,11.59
GND  (via drill 0.35)
  Top 0.508: 11.01,20.32 11.01,30.96 10.16,31.81 C5.2 10.16,35.72 10.16,52.39 | 11.01,20.32 11.01,18.95 | 11.01,18.95 LOGIC.14 | 11.01,20.32 LOGIC.17 | 11.01,18.95 11.21,18.95 LOGIC.16 | JOY.14 31.33,18.95 31.33,30.96 30.48,31.81 C4.2 30.32,35.72 30.32,49.53 JOY3.P$1 30.16,49.69 27.46,52.39 18.57,52.39 17.3,51.12 16.51,51.12 JOY3.8 16.35,50.96 15.56,50.96 14.13,52.39 10.16,52.39 | C1.2 62.86,32.07 63.18,31.75 | 63.18,31.75 UC1.8 | C3.2 99.69,39.69 106.36,33.02 UC3.14 108.43,27.15 108.43,23.65 | 10.16,52.39 8.25,52.39 5.4,49.53 JOY3.P$2 | C14.2 82.87,17.78 | 82.87,17.78 R2.1 79.22,17.62 79.22,17.3 77.79,15.88 65.25,15.88 UC2.10 65.09,16.19 63.34,17.94 v63.34,18.41 | 82.87,17.78 82.87,22.23 84.3,23.65 84.77,23.65 C13.2 84.93,23.65 108.43,23.65 | UC2.1 53.66,16.19 54.93,17.46 56.83,17.46 v57.78,18.41 | CON1.B1 108.59,6.03 C6.2 108.43,16.67 108.43,23.65 | JOY4.P$1 66.99,49.53 66.99,40.64 68.1,39.53 C3.2 | 63.18,31.75 67.95,36.51 67.95,39.37 C3.2
  Bottom 0.508: JOY3.P$1 JOY4.P$2 50.96,49.53 52.23,50.8 53.18,50.8 JOY4.8 53.34,51.12 53.34,51.91 55.72,54.29 62.23,54.29 63.5,50.8 64.77,49.53 JOY4.P$1 | v63.34,18.41 v57.78,18.41 | CON1.B1 108.9,26.67 UC3.14
  pour Bottom: -0.32,57.78 -0.32,10.48 112.08,10.48 112.08,49.85 103.82,58.1 0.32,58.1
JOY3-DOWN
  Top 0.254: RN1.2 17.94,42.86 17.94,45.56 20.48,48.1 JOY3.2 20.48,47.94 20.48,39.05 23.97,35.56 24.61,35.56 29.05,31.11 29.05,30.16 30.16,29.05 JOY.3
JOY3-FIRE  (via drill 0.35)
  Top 0.254: JOY.6 28.57,28.89 28.57,30.96 28.1,31.43 27.46,31.43 20,38.89 20,41.12 18.73,42.39 18.73,42.7 RN1.1 18.57,42.86 v19.37,43.66
  Bottom 0.254: v19.37,43.66 21.91,46.2 21.91,50.8 JOY3.6
JOY3-LEFT  (via drill 0.35)
  Top 0.254: RN1.3 17.14,42.86 17.14,47.47 JOY3.3 | v18.1,40.01 JOY.4
  Bottom 0.254: v18.1,40.01 18.1,42.7 17.78,43.02 JOY3.3
JOY3-RIGHT  (via drill 0.35)
  Top 0.254: RN1.4 16.19,42.86 16.19,46.99 15.08,48.1 JOY3.4 | JOY.5 25.08,32.07 v17.14,40.01
  Bottom 0.254: v17.14,40.01 17.14,43.02 15.08,45.09 15.08,48.1 JOY3.4
JOY3-UP  (via drill 0.35)
  Top 0.254: v34.45,44.61 34.92,44.13 34.92,42.86 RN2.4 | JOY.2 30.16,31.11 29.05,32.23 29.05,45.24 26.03,48.26 23.34,48.26 JOY3.1
  Bottom 0.254: v34.45,44.61 34.13,44.61 32.07,46.67 24.76,46.67 23.34,48.1 JOY3.1
JOY4-DOWN  (via drill 0.35)
  Top 0.254: RN3.3 55.24,42.86 55.24,44.45 57.31,46.51 57.31,48.1 JOY4.2 | JOY.9 26.19,22.86 27.46,24.13 v30.32,24.13
  Bottom 0.254: v30.32,24.13 30.64,24.13 33.02,26.51 35.24,26.51 36.83,28.1 36.83,33.34 38.58,35.08 48.42,35.08 49.05,35.72 49.05,40.48 48.89,40.64 48.89,41.27 51.43,43.81 52.23,43.81 55.56,47.15 56.36,47.15 57.31,48.1 JOY4.2
JOY4-FIRE  (via drill 0.35)
  Top 0.254: v58.74,48.42 58.74,47.31 56.04,44.61 56.04,42.86 RN3.2 | JOY.12 25.72,17.78 24.61,18.89 v24.13,18.89 | v22.38,28.89 22.38,29.21 20.96,30.64 20.96,31.11 v14.13,37.94 | JOY4.6 58.74,50.96 58.74,51.28 54.77,55.24 16.35,55.24 v14.76,53.66
  Bottom 0.254: v58.74,48.42 58.74,50.8 JOY4.6 | v24.13,18.89 24.13,19.21 22.38,20.95 v22.38,28.89 | v14.76,53.66 11.11,50.01 11.11,40.96 v14.13,37.94
JOY4-LEFT  (via drill 0.35)
  Top 0.254: v52.07,44.61 53.82,42.86 54.29,42.86 RN3.4 | v28.26,36.35 v28.26,33.81 | v36.67,43.97 36.67,49.21 40.48,53.02 46.83,53.02 50.64,49.21 53.66,49.21 54.61,48.26 JOY4.3
  Bottom 0.254: v52.07,44.61 52.07,44.77 54.61,47.31 JOY4.3 | JOY.10 27.62,23.97 26.67,24.92 26.67,32.23 v28.26,33.81 | v28.26,36.35 29.05,36.35 v36.67,43.97
JOY4-RIGHT  (via drill 0.35)
  Top 0.254: 38.02,44.69 40,46.67 50.32,46.67 51.75,48.1 JOY4.4 | 38.02,44.69 37.46,44.13 37.46,42.86 RN2.1 | JOY.11 26.19,20.32 27.15,19.37 28.1,19.37 28.89,20.16 v28.89,23.34 | v33.34,33.81 33.34,34.45 38.1,39.21 38.1,44.61 38.02,44.69
  Bottom 0.254: v28.89,23.34 28.89,26.51 28.57,26.83 28.57,30.32 32.07,33.81 v33.34,33.81
JOY4-UP  (via drill 0.35)
  Top 0.254: RN3.1 56.83,42.86 56.83,44.77 60.17,48.1 JOY4.1 60.01,48.1 57.63,50.48 57.63,51.75 54.61,54.77 39.69,54.77 31.12,46.2 31.12,45.72 31.27,45.56 v31.27,42.86 | JOY.7 25.08,24.29 24.45,23.65 24.13,23.65 20,27.78 v20,28.73 | v20.64,34.92 v20.64,32.38 | v26.99,41.27 v25.08,39.37
  Bottom 0.254: v20,28.73 20,29.05 19.37,29.69 19.37,31.11 v20.64,32.38 | v25.08,39.37 v20.64,34.92 | v26.99,41.27 29.69,41.27 v31.27,42.86
N$1
  Top 0.254: R2.2 77.47,21.59 C11.2
N$3  (via drill 0.35)
  Top 0.254: 85.09,21.91 88.42,21.91 91.12,19.21 L1.2 | 85.09,21.91 C13.1 85.09,21.91 | v80.96,20 C12.2 | 85.09,21.91 v83.82,20.64
  Bottom 0.254: v80.96,20 83.18,20 v83.82,20.64
N$4
  Top 0.254: 85.73,16.35 C14.1 | 85.73,16.35 R3.1 | 85.73,16.35 91.12,16.35 L1.1
N$6  (via drill 0.35)
  Top 0.254: v63.82,27.46 UC2.12
  Bottom 0.254: v63.82,27.46 63.82,27.78 64.14,28.1 64.14,35.88 UC1.10
N$7  (via drill 0.35)
  Top 0.254: UC2.13 62.55,27.46 v62.23,27.78
  Bottom 0.254: v62.23,27.78 62.23,35.24 UC1.11
N$8  (via drill 0.35)
  Top 0.254: UC2.14 61.28,27.78 61.6,28.1 61.6,30.8 v61.28,31.11
  Bottom 0.254: v61.28,31.11 61.28,33.66 UC1.12
N$9  (via drill 0.35)
  Top 0.254: UC2.15 60.01,27.78 v59.37,28.42
  Bottom 0.254: v59.37,28.42 59.37,33.02 UC1.13
N$10  (via drill 0.35)
  Top 0.254: UC2.16 58.74,26.67 v58.26,27.15 | v56.67,33.02 54.29,33.02 UC1.15
  Bottom 0.254: v58.26,27.15 57.94,27.46 57.78,27.46 56.67,28.57 v56.67,33.02
N$11
  Top 0.254: UC2.17 57.47,27.78 56.52,28.73 56.52,30.32 55.88,30.96 49.69,30.96 UC1.1
N$12  (via drill 0.35)
  Top 0.254: UC2.18 56.2,23.18 v56.04,23.02 | v52.71,24.13 52.71,26.99 UC1.2
  Bottom 0.254: v56.04,23.02 54.93,23.02 54.77,22.86 53.97,22.86 v52.71,24.13
N$13
  Top 0.254: UC2.19 54.93,27.3 UC1.3
SN-READY  (via drill 0.35)
  Top 0.254: v45.24,26.19 R1.1 43.34,24.13 v44.29,23.18 | v8.41,13.18 v3.02,18.57
  Bottom 0.254: v45.24,26.19 52.55,26.19 UC1.4 | LOGIC.5 4.76,27.46 3.02,25.72 v3.02,18.57 | v8.41,13.18 40.32,13.18 41.12,13.97 41.12,20 v44.29,23.18
SN-SND  (via drill 0.35)
  Top 0.254: C11.1 80.65,23.81 80.96,24.13 C12.1 80.96,24.29 v82.23,25.56 | v76.84,31.75 77.95,31.75 v78.58,32.38
  Bottom 0.254: UC1.7 63.18,27.78 63.02,27.62 63.02,27.3 63.66,26.67 63.98,26.67 64.61,27.3 64.61,30.32 66.04,31.75 v76.84,31.75 | v78.58,32.38 79.85,32.38 82.23,30 v82.23,25.56
SN_CE_WR  (via drill 0.35)
  Top 0.254: v22.54,19.21 22.54,17.62 25.88,14.29 27.62,14.29 v27.78,14.45 | v41.43,24.13 41.43,24.77 48.1,31.43 56.04,31.43 58.1,29.37 UC1.5 UC1.6
  Bottom 0.254: LOGIC.23 16.35,25.4 15.4,26.35 14.45,26.35 13.97,25.88 13.97,24.92 15.08,23.81 17.94,23.81 v22.54,19.21 | v27.78,14.45 36.51,14.45 40.64,18.57 40.64,23.34 v41.43,24.13
SN_CLK  (via drill 0.35)
  Top 0.254: LOGIC.26 20,30.48 v20.16,30.64 | v49.85,39.69 v40.32,39.69
  Bottom 0.254: v20.16,30.64 20.16,30.16 20,30 20,29.69 20.64,29.05 20.96,29.05 26.99,35.08 35.72,35.08 v40.32,39.69 | v49.85,39.69 50.17,39.69 UC1.14
SN_LATCH_DATA  (via drill 0.35)
  Top 0.254: UC2.11 65.09,24.13 60.64,19.68 57.15,19.68 v56.36,20.48 | v39.85,16.83 v45.88,16.83 | v35.88,15.24 v38.26,15.24 | v26.51,15.08 26.03,15.08 v23.34,17.78
  Bottom 0.254: v56.36,20.48 50.48,20.48 50.17,20.8 49.85,20.8 v45.88,16.83 | v38.26,15.24 v39.85,16.83 | v35.88,15.24 26.67,15.24 v26.51,15.08 | v23.34,17.78 23.34,19.37 18.26,24.45 15.87,24.45 LOGIC.24
TVC-SOUND
  Top 0.254: R3.2 80.33,13.97 77.79,11.43 71.76,11.43 70.8,10.48 CON1.A16

### Text on the board
tPlace: TVC / GameCard
bPlace: Billentyűzet oldal | by Sanyi / 2021 | rev2-smd